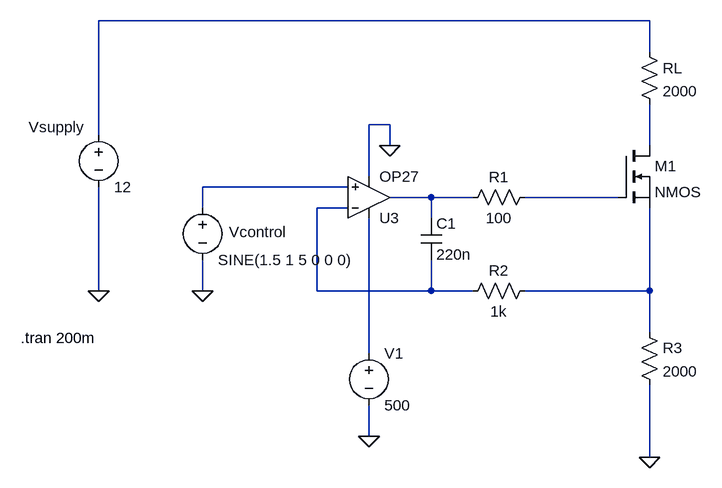
[diagram p0: schematic stim_controller_2.asc]
stim_controller_2.asc, the LTspice schematic file:
Version 4
SHEET 1 880 680
WIRE 480 -64 -368 -64
WIRE 480 -16 480 -64
WIRE 80 96 48 96
WIRE -368 112 -368 -64
WIRE 80 128 80 96
WIRE 480 128 480 64
WIRE 48 176 48 96
WIRE 16 192 -208 192
WIRE 144 208 80 208
WIRE 208 208 144 208
WIRE 432 208 288 208
WIRE -208 224 -208 192
WIRE 16 224 -32 224
WIRE 144 240 144 208
WIRE -368 352 -368 192
WIRE -208 352 -208 304
WIRE -32 352 -32 224
WIRE 144 352 144 304
WIRE 144 352 -32 352
WIRE 208 352 144 352
WIRE 480 352 480 224
WIRE 480 352 288 352
WIRE 480 416 480 352
WIRE 48 448 48 240
WIRE 48 576 48 528
WIRE 480 608 480 496
FLAG -208 352 0
FLAG -368 352 0
FLAG 480 608 0
FLAG 80 128 0
FLAG 48 576 0
SYMBOL voltage -208 208 R0
WINDOW 0 41 53 Left 2
WINDOW 123 0 0 Left 2
WINDOW 39 0 0 Left 2
SYMATTR InstName Vcontrol
SYMATTR Value SINE(1.5 1 5 0 0 0)
SYMBOL voltage -368 96 R0
WINDOW 0 -108 4 Left 2
WINDOW 123 0 0 Left 2
WINDOW 39 0 0 Left 2
SYMATTR InstName Vsupply
SYMATTR Value 12
SYMBOL res 464 -32 R0
WINDOW 0 36 41 Left 2
SYMATTR InstName RL
SYMATTR Value 2000
SYMBOL nmos 432 128 R0
SYMATTR InstName M1
SYMBOL res 304 192 R90
WINDOW 0 0 56 VBottom 2
WINDOW 3 32 56 VTop 2
SYMATTR InstName R1
SYMATTR Value 100
SYMBOL cap 128 240 R0
SYMATTR InstName C1
SYMATTR Value 220n
SYMBOL res 304 336 R90
WINDOW 0 0 56 VBottom 2
WINDOW 3 32 56 VTop 2
SYMATTR InstName R2
SYMATTR Value 1k
SYMBOL res 464 400 R0
SYMATTR InstName R3
SYMATTR Value 2000
SYMBOL Opamps/OP27 48 272 M180
SYMATTR InstName U3
SYMBOL voltage 48 432 R0
SYMATTR InstName V1
SYMATTR Value 500
TEXT -488 424 Left 2 !.tran 200m

The netlist it stands for:
* stim_controller_2.asc
Vcontrol N003 0 SINE(1.5 1 5 0 0 0)
Vsupply N001 0 12
RL N001 N002 2000
M1 N002 N005 N007 N007 NMOS
R1 N005 N004 100
C1 N004 N006 220n
R2 N007 N006 1k
R3 N007 0 2000
XU3 N003 N006 N008 0 N004 OP27  ; pins In+ In- V+ V- OUT
V1 N008 0 500
.model NMOS NMOS
.model PMOS PMOS
.lib standard.mos
.tran 200m
.lib ADI.lib
.backanno
.end